# EAGLE design RFIDLockShield (EAGLE 5.10)
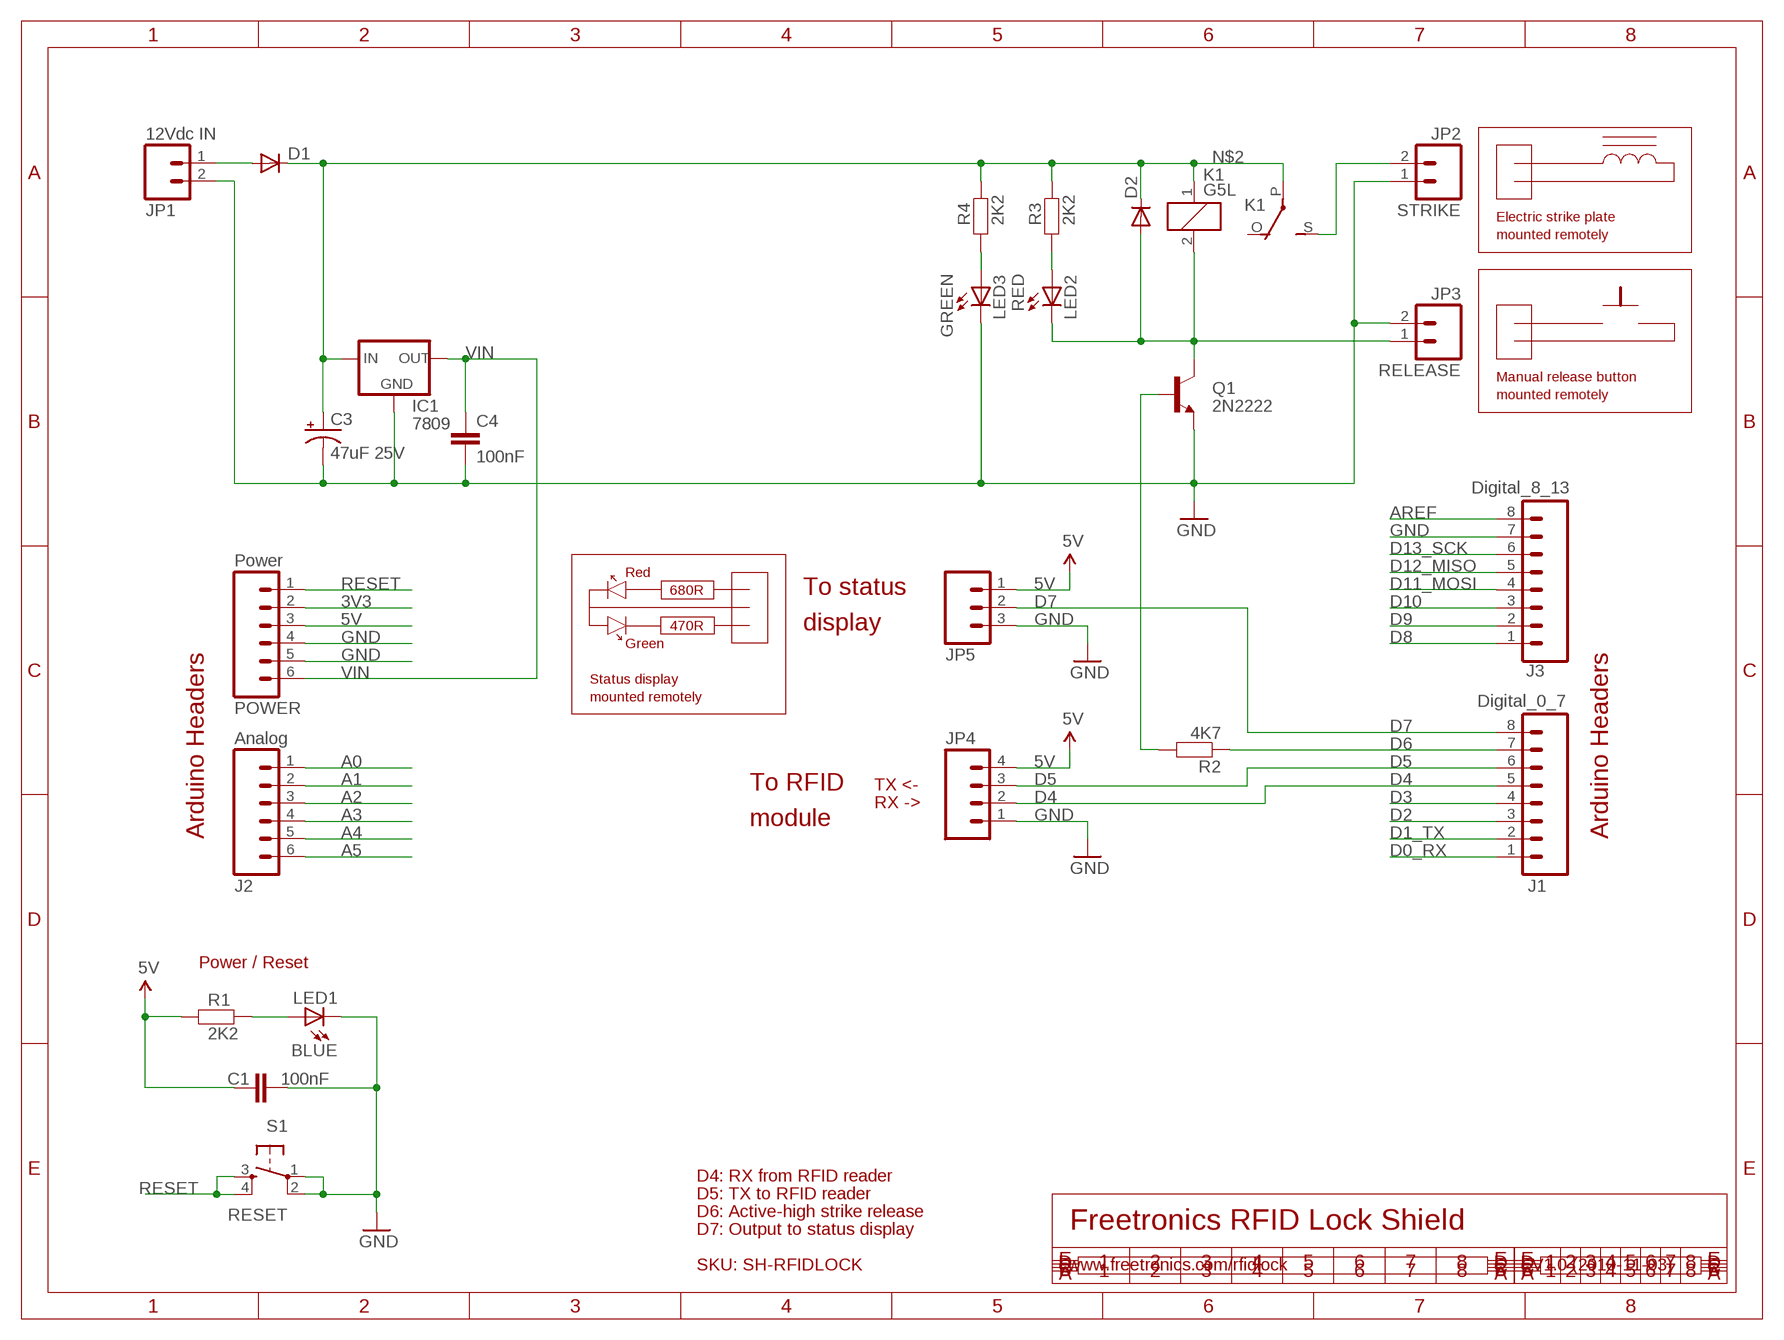
[diagram p0: schematic, sheet 1]

## Parts
C1  100nF  CAPPTH  [CAP-PTH-SMALL]
C3  47uF 25V  CAP_POLPTH2  [CPOL-RADIAL-10UF-25V]
C4  100nF  CAPPTH  [CAP-PTH-SMALL]
D1  DIODEPTH  [DIODE-1N4001]
D2  DIODEPTH  [DIODE-1N4001]
IC1  7809  V_REG_78XXSIDE  [78XXL]
J1  Digital_0_7  M08  [1X08]
J2  Analog  M06SIP  [1X06]
J3  Digital_8_13  M08  [1X08]
JP1  12Vdc IN  M025MM  [SCREWTERMINAL-5MM-2]
JP2  STRIKE  M025MM  [SCREWTERMINAL-5MM-2]
JP3  RELEASE  M02PTH  [1X02]
JP4  M04PTH  [1X04]
JP5  M03PTH  [1X03]
K1  G5L  [G5LE]
LED1  BLUE  LED3MM  [LED3MM]
LED2  RED  LED3MM  [LED3MM]
LED3  GREEN  LED3MM  [LED3MM]
POWER  Power  M06SIP  [1X06]
Q1  2N2222  TRANSISTOR_NPNTO92  [TO-92]
R1  2K2  FREETRONICS_RESISTORPTH2  [FREETRONICS_AXIAL-0.4]
R2  4K7  FREETRONICS_RESISTORPTH2  [FREETRONICS_AXIAL-0.4]
R3  2K2  FREETRONICS_RESISTORPTH2  [FREETRONICS_AXIAL-0.4]
R4  2K2  FREETRONICS_RESISTORPTH2  [FREETRONICS_AXIAL-0.4]
S1  RESET  TAC_SWITCHPTH  [TACTILE-PTH]

## Nets
3V3: POWER.2
5V: C1.1 JP4.4 JP5.1 POWER.3 R1.P$1
A0: J2.1
A1: J2.2
A2: J2.3
A3: J2.4
A4: J2.5
A5: J2.6
AREF: J3.8
D0_RX: J1.1
D1_TX: J1.2
D2: J1.3
D3: J1.4
D4: J1.5 JP4.2
D5: J1.6 JP4.3
D6: J1.7 R2.P$1
D7: J1.8 JP5.2
D8: J3.1
D9: J3.2
D10: J3.3
D11_MOSI: J3.4
D12_MISO: J3.5
D13_SCK: J3.6
GND: C1.2 C3.2(-) C4.2 IC1.GND J3.7 JP1.2 JP2.1 JP3.2 JP4.1 JP5.3 LED1.K(C) LED3.K(C) POWER.4 POWER.5 Q1.1(E) S1.1 S1.2
N$1: LED1.A R1.P$2
N$2: C3.1(+) D1.C D2.C IC1.IN K1.1 K1.P(2:P) R3.P$2 R4.P$2
N$3: D1.A JP1.1
N$4: D2.A JP3.1 K1.2 LED2.K(C) Q1.3(C)
N$5: LED2.A R3.P$1
N$6: Q1.2(B) R2.P$2
N$7: LED3.A R4.P$1
N$192: JP2.2 K1.S(2:S)
RESET: POWER.1 S1.3 S1.4
VIN: C4.1 IC1.OUT POWER.6
Unconnected: K1.O(2:O)

## Notes on the sheet
- Electric strike plate
- mounted remotely
- Manual release button
- mounted remotely
- Red
- 680R | To status
- 470R | display
- Green
- Status display
- mounted remotely
- To RFID | TX <-
- RX ->
- module
- Arduino Headers | Arduino Headers
- Power / Reset
- D4: RX from RFID reader
- D5: TX to RFID reader
- D6: Active-high strike release
- Freetronics RFID Lock Shield
- D7: Output to status display
- SKU: SH-RFIDLOCK | www.freetronics.com/rfidlock | V1.0 (2010-11-03)

## Library data of the parts
C1 C4 = freetronics:CAP: Capacitor Standard 0603 ceramic capacitor, and 0.1" leaded capacitor.
C3 = freetronics-jon.1:CAP_POL: Capacitor Polarized These are standard SMD and PTH capacitors. Normally 10uF, 47uF, and 100uF in electrolytic and tantalum varieties. Always verify the external diameter of the through hole cap, it varies with capacity, voltage, and manufacturer. The EIA devices should be standard.
D1 D2 = freetronics-master-v1:DIODE: Diode These are standard reverse protection diodes and small signal diodes. SMA package can handle up to about 1A. SOD-323 can handle about 200mA. What the SOD-323 package when ordering, there are some mfgs out there that are 5-pin packages.
IC1 = freetronics-master-v1:V_REG_78XX: Voltage Regulator Standard 7805 5V regulator. IGO (Input Ground Output). Spark Fun Electronics SKU : COM-00107
J1 J3 = freetronics:M08: Header 8 Standard 8-pin 0.1" header. Use with straight break away headers (SKU : PRT-00116), right angle break away headers (PRT-00553), swiss pins (PRT-00743), machine pins (PRT-00117), and female headers (PRT-00115).
J2 POWER = freetronics:M06: Header 6 Standard 6-pin 0.1" header. Use with straight break away headers (SKU : PRT-00116), right angle break away headers (PRT-00553), swiss pins (PRT-00743), machine pins (PRT-00117), and female headers (PRT-00115). Molex polarized connector foot print use with SKU : PRT-08094 with associated crimp pins and housings. NOTES ON THE VARIANTS LOCK and LOCK_LONGPADS... This footprint was designed to help hold the alignment of a through-hole component (i.e. 6-pin header) while soldering it into place. You may notice that each hole has been shifted either up or down by 0.005 of an inch from it's more standard position (which is a perfectly straight line). This slight alteration caused the pins (the squares in the middle) to touch the edges of the holes. Because they are alternating, it causes a "brace" to hold the component in place. 0.005 has proven to be the perfect amount of "off-center" position when using our standard breakaway headers. Although looks a little odd when you look at the bare footprint, once you have a header in there, the alteration is very hard to notice. Also, if you push a header all the way into place, it is covered up entirely on the bottom side. This idea of altering the position of holes to aid alignment will be further integrated into the Sparkfun Library for other footprints. It can help hold any component with 3 or more connection pins.
JP1-JP3 = freetronics-master-v1:M02: Header 2 Standard 2-pin 0.1" header. Use with straight break away headers (SKU : PRT-00116), right angle break away headers (PRT-00553), swiss pins (PRT-00743), machine pins (PRT-00117), and female headers (PRT-00115). Molex polarized connector foot print use with SKU : PRT-08233 with associated crimp pins and housings.
JP4 = freetronics-master-v1:M04: Header 4 Standard 4-pin 0.1" header. Use with straight break away headers (SKU : PRT-00116), right angle break away headers (PRT-00553), swiss pins (PRT-00743), machine pins (PRT-00117), and female headers (PRT-00115). Molex polarized connector foot print use with SKU : PRT-08231 with associated crimp pins and housings.
JP5 = freetronics-master-v1:M03: Header 3 Standard 3-pin 0.1" header. Use with straight break away headers (SKU : PRT-00116), right angle break away headers (PRT-00553), swiss pins (PRT-00743), machine pins (PRT-00117), and female headers (PRT-00115). Molex polarized connector foot print use with SKU : PRT-08232 with associated crimp pins and housings.
K1 = relay:G5L: RELAY 1 x switch, 10 A/120 V AC, 8 A/30 V ADC, Omron
LED1-LED3 = freetronics:LED: LEDs Standard schematic elements and footprints for 5mm, 3mm, 1206, and 0603 sized LEDs. 5mm - Spark Fun Electronics SKU : COM-00529 (and others)
Q1 = freetronics-original:TRANSISTOR_NPN: Transistor NPN BJT configuration in SOT23 package. MMBT2222 is the common NPN we use. Double check BCE configuration again layout.
R1-R4 = freetronics:FREETRONICS_RESISTOR: Resistor Basic schematic elements and footprints for 0603, 1206, and PTH 1/10th watt (small) resistors.
S1 = freetronics:TAC_SWITCH: Momentary Switch Button commonly used for reset or general input. Spark Fun Electronics SKU : COM-00097

## Board
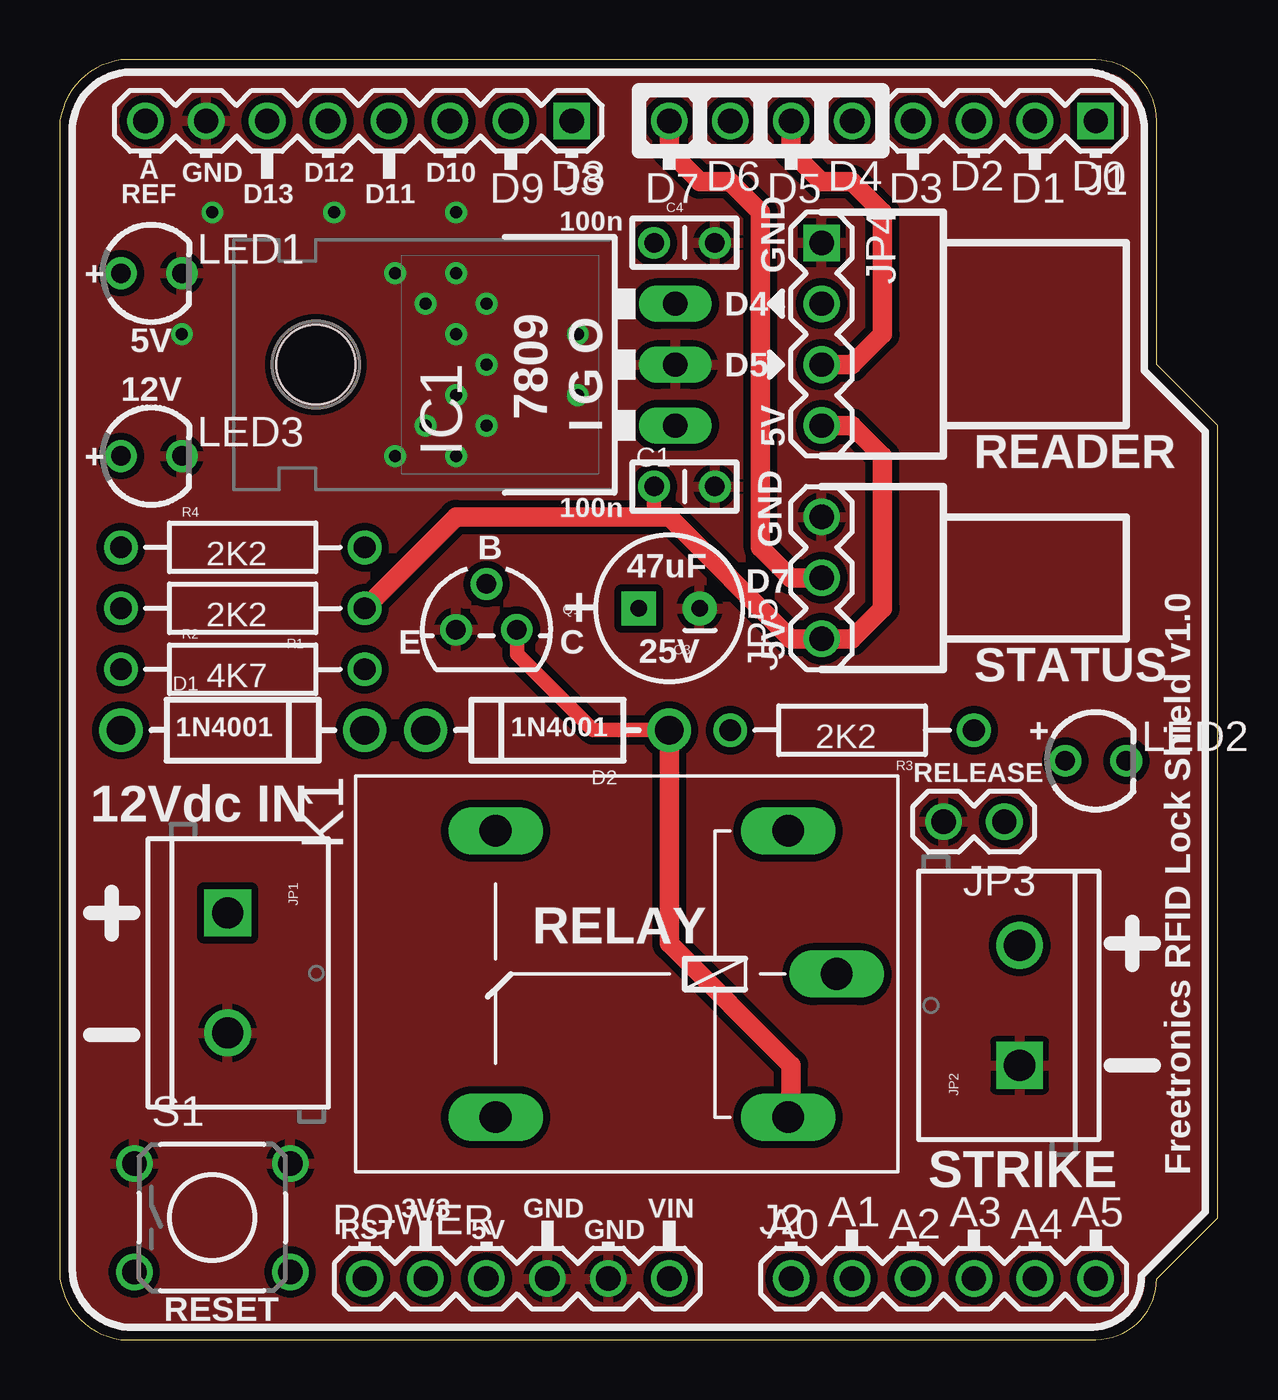
[diagram p1: board, top side]
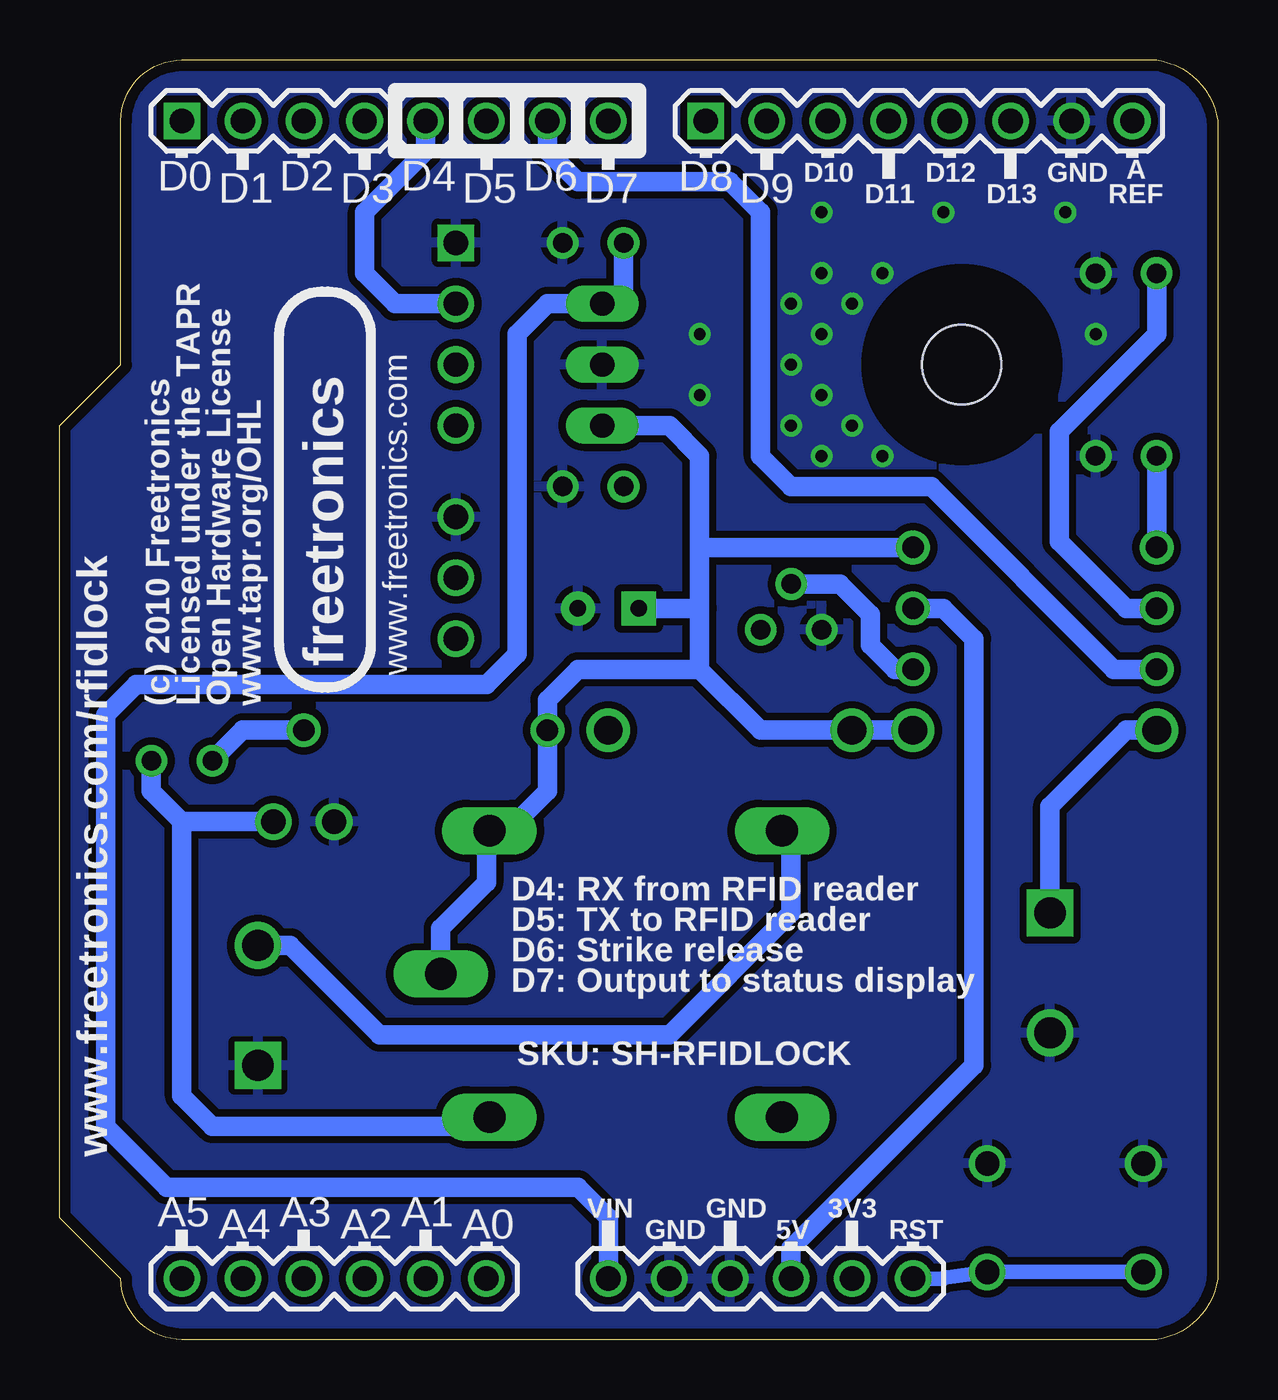
[diagram p2: board, bottom side, seen from below]

Size 48.26 x 53.34 mm. Coordinates in mm from the lower left corner, seen from the top.
Outline: 0,2.54 arc74 2.54,0 43.18,0 arc90 45.72,2.54 48.26,5.08 48.26,38.1 45.72,40.64 45.72,50.8 arc90 43.18,53.34 2.54,53.34 arc74 0,50.8 0,2.54
Copper layers (1*16): Top 0.035mm / dielectric 1.5mm / Bottom 0.035mm
Design rules "default *": minimum track width 10mil, minimum drill 24mil, track to track 12mil, track to pad 12mil, pad to pad 12mil, via to via 12mil, smd to smd 8mil, copper to edge 18mil, drill to drill 8mil, minimum pad ring 10mil, minimum via ring 8mil, stop-mask expansion 4mil, vias tented up to drill 0mil, thermal gap 10mil

### Footprints (pad centres in the part's own frame; a part is rotated, then mirrored left to right if it is on the bottom)
CAP-PTH-SMALL = drill 0.813 round: 1 0,0; 2 2.54,0
CPOL-RADIAL-10UF-25V = drill 0.7 pad 1.422 square: 1 1.27,0 | drill 0.7 pad 1.422 round: 2 -1.27,0
DIODE-1N4001 = drill 1.2 round: A -5.08,0; C 5.08,0
78XXL = drill 1.016 long: GND 0,-3.81; IN -2.54,-3.81; OUT 2.54,-3.81 | hole 3.302: 0,11.176
1X08 = drill 1.016 square: 1 0,0 | drill 1.016 round: 2 2.54,0; 3 5.08,0; 4 7.62,0; 5 10.16,0; 6 12.7,0; 7 15.24,0; 8 17.78,0
1X06 = drill 1.016 round: 1 0,0; 2 2.54,0; 3 5.08,0; 4 7.62,0; 5 10.16,0; 6 12.7,0
SCREWTERMINAL-5MM-2 = drill 1.3 square: 1 0,0 | drill 1.3 round: 2 5,0
1X02 = drill 1.016 round: 1 0,0; 2 2.54,0
1X04 = drill 1.016 square: 1 0,0 | drill 1.016 round: 2 2.54,0; 3 5.08,0; 4 7.62,0
1X03 = drill 1.016 round: 1 0,0; 2 2.54,0; 3 5.08,0
G5LE = drill 1.321 long: 1 -7.493,-5.969; 2 -7.493,5.969; O 4.699,5.969; P -9.525,0; S 4.699,-5.969
LED3MM = drill 0.813 round: A -1.27,0; K 1.27,0
TO-92 = drill 0.813 round: 1 -1.27,0; 2 0,1.905; 3 1.27,0
FREETRONICS_AXIAL-0.4 = drill 0.9 round: P$1 -5.08,0; P$2 5.08,0
TACTILE-PTH = drill 1.016 round: 1 -3.251,2.261; 2 3.251,2.261; 3 -3.251,-2.261; 4 3.251,-2.261

### Placement (x,y rotation side)
C1  24.77,35.56 0 top
C3  25.4,30.48 180 top
C4  24.77,45.72 0 top
D1  7.62,25.4 0 top
D2  20.32,25.4 180 top
IC1  21.84,40.64 90 top
J1  43.18,50.8 180 top
J2  30.48,2.54 0 top
J3  21.34,50.8 180 top
JP1  6.99,17.78 270 top
JP2  40.01,11.43 90 top
JP3  39.37,21.59 180 top
JP4  31.75,45.72 270 top
JP5  31.75,29.21 90 top
K1  22.86,15.24 180 top
LED1  3.81,44.45 0 top
LED2  43.18,24.13 0 top
LED3  3.81,36.83 0 top
POWER  12.7,2.54 0 top
Q1  17.78,29.59 0 top
R1  7.62,30.48 180 top
R2  7.62,27.94 0 top
R3  33.02,25.4 180 top
R4  7.62,33.02 0 top
S1  6.35,5.08 0 top

### Tracks (layer width: path | path; a pad name or v marks a point on that pad's centre or on a via)
5V
  Top 0.61: 24.77,34.29 C1.1
  Top 0.813: JP4.4 33.02,38.1 34.29,36.83 34.29,30.48 33.02,29.21 JP5.1 30.48,29.21 25.4,34.29 24.77,34.29 16.51,34.29 R1.P$1
  Bottom 0.813: POWER.3 17.78,3.81 10.16,11.43 10.16,29.21 11.43,30.48 R1.P$1
D4
  Bottom 0.813: JP4.2 34.29,43.18 35.56,44.45 35.56,46.99 33.02,49.53 J1.5
D5
  Top 0.813: JP4.3 33.02,40.64 34.29,41.91 34.29,46.99 33.02,48.26 31.75,48.26 30.48,49.53 J1.6
D6
  Bottom 0.813: R2.P$1 4.32,27.94 11.94,35.56 17.78,35.56 19.05,36.83 19.05,46.99 20.32,48.26 26.67,48.26 27.94,49.53 J1.7
D7
  Top 0.813: J1.8 25.4,49.53 26.67,48.26 27.94,48.26 29.21,46.99 29.21,33.02 30.48,31.75 JP5.2
GND  (via drill 0.5)
  other vias: 17.78,43.18 17.78,40.64 17.78,38.1 16.51,36.83 13.97,44.45 13.97,36.83 5.08,41.91 15.24,43.18 16.51,39.37 16.51,41.91 16.51,44.45 15.24,38.1 6.35,46.99 11.43,46.99 16.51,46.99 21.59,41.91 21.59,39.37
  pour Bottom: 0,50.8 arc-74 2.54,53.34 43.18,53.34 arc-74 45.72,50.8 45.72,40.64 48.26,38.1 48.26,5.08 45.72,2.54 arc-74 43.18,0 2.54,0 arc-74 0,2.54
  pour Top: 0,50.8 arc-74 2.54,53.34 43.18,53.34 arc-74 45.72,50.8 45.72,40.64 48.26,38.1 48.26,5.08 45.72,2.54 arc-74 43.18,0 2.54,0 arc-74 0,2.54
N$1
  Bottom 0.813: R1.P$2 3.81,30.48 6.6,33.27 6.6,37.85 2.54,41.91 LED1.A
N$2
  Bottom 0.813: K1.P 32.38,17.14 30.48,19.05 30.48,21.08 K1.1 29.59,21.21 27.94,22.86 R3.P$2 27.94,26.67 26.67,27.94 21.59,27.94 | 21.59,27.94 19.05,25.4 D2.C D1.C | IC1.IN 22.86,38.1 21.59,36.83 21.59,33.02 | 21.59,33.02 R4.P$2 | 21.59,27.94 21.59,30.48 | 21.59,30.48 21.59,33.02 | 21.59,30.48 C3.1
N$3
  Bottom 0.813: JP1.1 6.99,22.23 3.81,25.4 D1.A
N$4
  Top 0.61: Q1.3 19.05,28.57 22.23,25.4 D2.A | K1.2 30.48,9.4
  Top 0.813: D2.A 25.4,16.51 30.48,11.43 30.48,9.4
  Bottom 0.61: K1.2 30.73,8.89
  Bottom 0.813: 30.73,8.89 41.91,8.89 43.18,10.16 43.18,21.59 | 43.18,21.59 44.45,22.86 LED2.K | 43.18,21.59 JP3.1
N$5
  Bottom 0.813: R3.P$1 40.64,25.4 LED2.A
N$6
  Bottom 0.813: R2.P$2 13.46,27.94 14.48,28.96 14.48,30.23 15.75,31.5 Q1.2
N$7
  Bottom 0.813: R4.P$1 LED3.A
N$192
  Bottom 0.813: JP2.2 38.66,16.43 34.92,12.7 22.86,12.7 17.78,17.78 17.78,20.83 K1.S
RESET
  Bottom 0.61: S1.3 S1.4 11.4,2.56 11.43,2.54 POWER.1
VIN
  Bottom 0.61: IC1.OUT 24.77,43.81
  Bottom 0.813: 24.77,43.81 C4.1 | IC1.OUT 27.94,43.18 29.21,41.91 29.21,28.57 30.48,27.3 45.09,27.3 46.35,26.04 46.35,8.89 43.81,6.35 26.67,6.35 25.4,5.08 POWER.6

### Text on the board
tPlace: A | GND | D12 | D10 | D8 | D6 | D4 | D2 | D0 | REF | D13 | D11 | D9 | D7 | D5 | D3 | D1 | 100n | + | GND | D4 | 5V | D5 | 12V | 7809 | I G O | 5V | + | READER | 100n | B | GND | 47uF | D7 | + | E | C | 25V | 5V | STATUS | 1N4001 | 1N4001 | + | RELEASE | 12Vdc IN | RELAY | Freetronics RFID Lock Shield v1.0 | STRIKE | 3V3 | GND | VIN | A1 | A3 | A5 | RST | 5V | GND | A0 | A2 | A4 | RESET
bPlace: A | GND | D12 | D10 | D8 | D6 | D4 | D2 | D0 | REF | D13 | D11 | D9 | D7 | D5 | D3 | D1 | www.freetronics.com | freetronics | www.tapr.org/OHL | Open Hardware License | Licensed under the TAPR | (c) 2010 Freetronics | D4: RX from RFID reader | D5: TX to RFID reader | D6: Strike release | D7: Output to status display | SKU: SH-RFIDLOCK | www.freetronics.com/rfidlock | 3V3 | GND | VIN | A1 | A3 | A5 | RST | 5V | GND | A0 | A2 | A4